# Altium schematic sheet LPEDT_revA1_bikeit_DISPLAY_MECH.SchDoc: Display Mechanical
size A; Author: Dhruva Koley; DocumentNumber: 11; Revision: 1; SheetNumber: 11; SheetTotal: 12
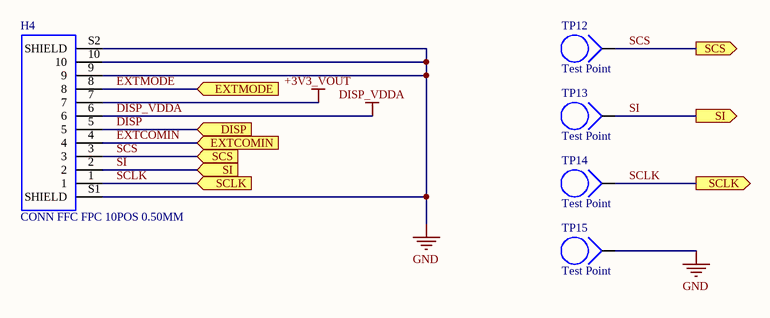
[diagram p0: LPEDT_revA1_bikeit_DISPLAY_MECH.SchDoc]

## Parts
H4  CONN FFC FPC 10POS 0.50MM  [AYF531035A]
TP12  Test Point
TP13  Test Point
TP14  Test Point
TP15  Test Point

## Ports
DISP (in), EXTCOMIN (in), EXTMODE (in), SCLK (in), SCLK (out), SCS (in), SCS (out), SI (in), SI (out)

## Nets
+3V3_VOUT: H4.7
DISP_VDDA: H4.6
GND: H4.9 H4.10 H4.S1(SHIELD) H4.S2(SHIELD) TP15.1
DISP: H4.5 ; port DISP
EXTCOMIN: H4.4 ; port EXTCOMIN
EXTMODE: H4.8 ; port EXTMODE
SCLK: H4.1 TP14.1 ; port SCLK
SCS: H4.3 TP12.1 ; port SCS
SI: H4.2 TP13.1 ; port SI

## Library data of the parts
H4 = AYF531035A: 10 Position 0.5 mm Solder Right Angle FFC / FPC SMD Socket; Manufacturer: Panasonic; Actuator Material: Polymer,Liquid Crystal Polymer; Voltage Rating: 50V; Current Rating: 500mA; Number of Positions: 10; Pitch: 0.02inch; Manufacturer Part Number: AYF531035A; RoHS: Yes; Category: FFC / FPC; Stock 1: 2493; Pricing 1: 1=0.93000, 10=0.81600, 25=0.76800, 50=0.73600, 100=0.70400, 250=0.64000, 500=0.57600, 1000=0.51200, 2500=0.46400 (USD); Mount: Surface Mount; Contact Plating: Gold; Contact Material: Copper Alloy; Housing Material: Polymer; Min Operating Temperature: -55°C; Max Operating Temperature: 85°C; Package Quantity: 500; Packaging: Cut Strip; Termination: Solder; Lead Free: Lead Free; Flammability Rating: UL94 V-0; ComponentLink1URL: https://www3.panasonic.biz/ac/e_download/control/connector/fpc-ffc/catalog/con_eng_y5bw.pdf?src-supplier=Digi-Key; ComponentLink1Description: https://www3.panasonic.biz/ac/e_download/control/connector/fpc-ffc/catalog/con_eng_y5bw.pdf?src-supplier=Digi-Key; ComponentLink2URL: http://www3.panasonic.biz/ac/e_download/control/connector/fpc-ffc/catalog/con_eng_y5bw.pdf?src-supplier=Digi-Key; ComponentLink2Description: http://www3.panasonic.biz/ac/e_download/control/connector/fpc-ffc/catalog/con_eng_y5bw.pdf?src-supplier=Digi-Key; Supplier 1: Digi-Key; Supplier Part Number 1: 255-5667-ND
TP12-TP15 = Test Pad